# EAGLE design max30208-breakout (EAGLE 9.6.2)
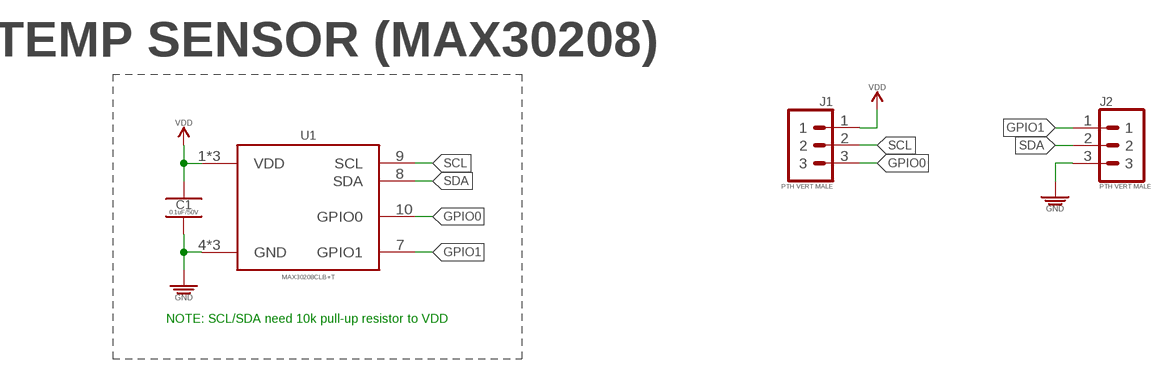
[diagram p0: schematic, sheet 1]

## Parts
C1  0.1uF/50V  0.1UF_SMD-0402_50V-10%  [CAPC1005X55_SMD-0402]
J1  PTH VERT MALE  1X03_PTH_VERT_MALE_2.54MM  [HDRV3W64P254_1X3_762X254X838B]
J2  PTH VERT MALE  1X03_PTH_VERT_MALE_2.54MM  [HDRV3W64P254_1X3_762X254X838B]
U1  MAX30208CLB+T  MAX30208  [SON65P200X200X85-6N]

## Nets
GND: C1.2 J2.3 U1.4(GND) U1.5(GND) U1.6(GND)
GPIO0: J1.3 U1.10(GPIO0)
GPIO1: J2.1 U1.7(GPIO1)
SCL: J1.2 U1.9(SCL)
SDA: J2.2 U1.8(SDA)
VDD: C1.1 J1.1 U1.1(VDD) U1.2(VDD) U1.3(VDD)

## Notes on the sheet
- TEMP SENSOR (MAX30208)
- NOTE: SCL/SDA need 10k pull-up resistor to VDD

## Library data of the parts
C1 = _capacitors:0.1UF; DATASHEET: https://product.tdk.com/info/en/catalog/datasheets/mlcc_commercial_soft_en.pdf; DIST: Digikey; DISTLINK: https://www.digikey.com/products/en?keywords=445-173610-1-ND; DISTPN: 445-173610-1-ND; MFR: TDK Corporation; MPN: C1005X7R1H104K050BE
J1 J2 = _connectors:1X03; DATASHEET: https://s3.amazonaws.com/catalogspreads-pdf/PAGE112-113%20.100%20MALE%20HDR.pdf; DIST: Digikey; DISTLINK: https://www.digikey.com/en/products/detail/sullins-connector-solutions/PEC03SAAN/859156?s=N4IgTCBcDaIMoEYAMCwFEC0SDMGByAIiALoC%2BQA; DISTPN: S1012E-03-ND; MFR: Sullins Connector Solutions; MPN: PEC03SAAN
U1 = _sensors:MAX30208: IC TEMP SENSOR Temperature Sensor Digital, Local 0°C ~ 70°C 16 b 10-LGA (2x2); DATASHEET: https://datasheets.maximintegrated.com/en/ds/MAX30208.pdf; DIST: Digikey; DISTLINK: https://www.digikey.com/en/products/detail/maxim-integrated/MAX30208CLB-T/10378675?s=N4IgTCBcDaIIwHYCsBaAsgQQBoGYAMYeAHAMIAyAQgNQAqJNKAcgCIgC6AvkA; DISTPN: 175-MAX30208CLB+TCT-ND; MFR: Maxim Integrated; MPN: MAX30208CLB+T

## Board
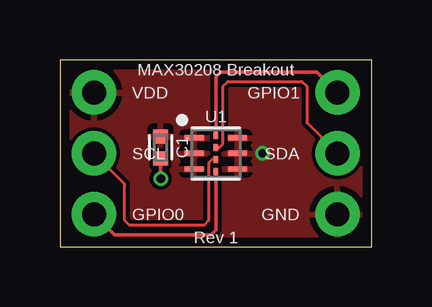
[diagram p1: board, top side]
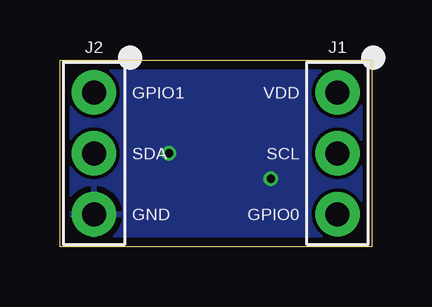
[diagram p2: board, bottom side, seen from below]

Size 13 x 7.8 mm. Coordinates in mm from the lower left corner, seen from the top.
Outline: 0,0 13,0 13,7.8 0,7.8 0,0
Copper layers (1*16): Top 0.035559375mm / dielectric 1.6mm / Bottom 0.035559375mm
Design rules "oshpark-2layer": minimum track width 6mil, minimum drill 10mil, track to track 6mil, track to pad 6mil, pad to pad 6mil, via to via 6mil, smd to smd 6mil, copper to edge 15mil, drill to drill 6mil, minimum pad ring 5mil, minimum via ring 5mil, stop-mask expansion 2.5mil, vias tented up to drill 0mil, thermal gap 10mil

### Footprints (pad centres in the part's own frame; a part is rotated, then mirrored left to right if it is on the bottom)
CAPC1005X55_SMD-0402 = smd 0.585 x 0.612: 1 -0.458,0; 2 0.458,0
HDRV3W64P254_1X3_762X254X838B = drill 1 pad 1.85: 1 -2.54,0; 2 0,0; 3 2.54,0
SON65P200X200X85-6N = smd 0.8 x 0.22: 1 -0.9,0.65; 2 -0.9,0; 3 -0.9,-0.65; 4 0.9,-0.65; 5 0.9,0; 6 0.9,0.65 | smd 0.2 x 0.3: 7 0,0.75; 8 0,0.25; 9 0,-0.25; 10 0,-0.75

### Placement (x,y rotation side)
C1  4.2,4.15 270 top
J1  1.42,3.9 270 bottom
J2  11.58,3.9 270 bottom
U1  6.5,3.9 0 top

### Tracks (layer width: path | path; a pad name or v marks a point on that pad's centre or on a via)
GND  (via drill 0.35 pad 0.15)
  Top 0.152: C1.2 v4.2,2.85
  other vias: 8.45,3.9
  pour Bottom: 0,0 13,0 13,7.8 0,7.8
  pour Top: 6.4,0 13,0 13,7.8 6.4,7.8
GPIO0
  Top 0.152: U1.10 6.5,0.7 6.3,0.5 2.28,0.5 J1.3
GPIO1
  Top 0.152: J2.1 10.72,7.3 6.7,7.3 6.5,7.1 U1.7
SCL
  Top 0.127: U1.9 6.35,3.65 6.2,3.5 6.2,1.1 6,0.9 2.9,0.9 2.7,1.1 2.7,2.62 J1.2
SDA
  Top 0.127: U1.8 6.65,4.15 6.8,4.3 6.8,6.7 7,6.9 10.1,6.9 10.3,6.7 10.3,5.18 J2.2
VDD
  pour Top (rank 2): 0,0 6.6,0 6.6,7.8 0,7.8

### Text on the board
tPlace: MAX30208 Breakout | VDD | GPIO1 | SCL | SDA | GPIO0 | GND | Rev 1
bPlace: VDD | GPIO1 | SCL | SDA | GPIO0 | GND